# EAGLE design blink1micro-programming-jig (EAGLE 9.1.3)
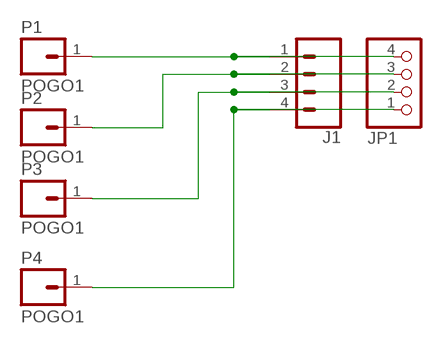
[diagram p0: schematic, sheet 1]

## Parts
J1  CONN_04  [1X04]
JP1  PINHD-1X4/90  [1X04/90]
P1  POGO1  [MILLMAX-0928-POGO-THRU]
P2  POGO1  [MILLMAX-0928-POGO-THRU]
P3  POGO1  [MILLMAX-0928-POGO-THRU]
P4  POGO1  [MILLMAX-0928-POGO-THRU]

## Nets
N$1: J1.1 JP1.4 P1.1
N$2: J1.2 JP1.3 P2.1
N$3: J1.3 JP1.2 P3.1
N$4: J1.4 JP1.1 P4.1

## Library data of the parts
J1 = SparkFun-Connectors:CONN_04: Multi connection point. Often used as Generic Header-pin footprint for 0.1 inch spaced/style header connections On any of the 0.1 inch spaced packages, you can populate with these: Break Away Headers - Straight <https://www.sparkfun.com/products/116> (PRT-00116) Break Away Male Headers - Right Angle <https://www.sparkfun.com/products/553> (PRT-00553) Female Headers <https://www.sparkfun.com/products/115> (PRT-00115) Break Away Headers - Machine Pin <https://www.sparkfun.com/products/117> (PRT-00117) Break Away Female Headers - Swiss Machine Pin <https://www.sparkfun.com/products/743> (PRT-00743) For SCREWTERMINALS and SPRING TERMINALS visit here: Screw Terimnals on SparkFun.com <https://www.sparkfun.com/search/results?term=Screw+Terminals> (5mm/3.5mm/2.54mm spacing) This device is also useful as a general connection point to wire up your design to another part of your project. Our various solder wires solder well into these plated through hole pads. Hook-Up Wire - Assortment (Stranded, 22 AWG) <https://www.sparkfun.com/products/11375> (PRT-11375) Hook-Up Wire - Assortment (Solid Core, 22 AWG) <https://www.sparkfun.com/products/11367> (PRT-11367) View the entire wire category on our website here <https://www.sparkfun.com/categories/141> Special notes: Molex polarized connector foot print use with SKU : PRT-08231 with associated crimp pins and housings. 1MM SMD Version SKU: PRT-10208; PROD_ID: CONN-09696
JP1 = pinhead:PINHD-1X4: PIN HEADER
P1-P4 = todstuff:POGO1

## Board
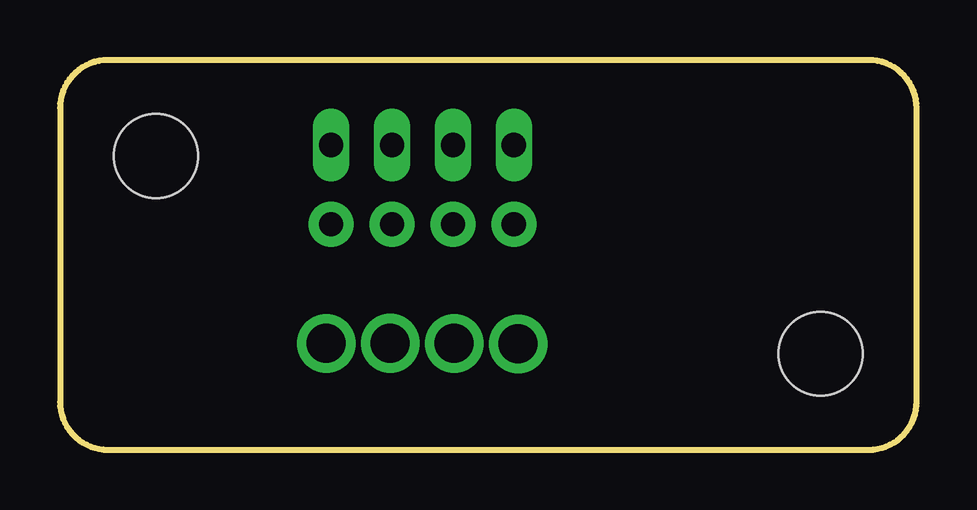
[diagram p1: board, top side]
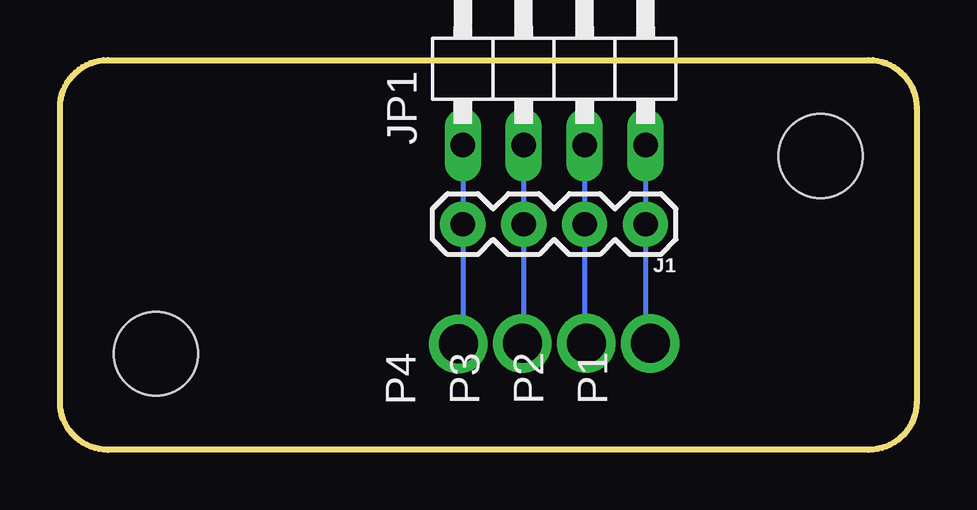
[diagram p2: board, bottom side, seen from below]

Size 35.72 x 16.24 mm. Coordinates in mm from the lower left corner, seen from the top.
Outline: 2,0 33.72,0 arc90 35.72,2 35.72,14.24 arc90 33.72,16.24 2,16.24 arc90 0,14.24 0,2 arc90 2,0
Copper layers (1*16): Top 0.035mm / dielectric 0.785mm / Bottom 0.035mm
Design rules "SeeedStudio_2layer_DRU_no_angle_20140221_blink1thin": minimum track width 6mil, minimum drill 12mil, track to track 6mil, track to pad 6mil, pad to pad 6mil, via to via 6mil, smd to smd 0mil, copper to edge 10mil, drill to drill 10mil, minimum pad ring 10mil, minimum via ring 6mil, stop-mask expansion 2mil, vias tented up to drill 100mil, thermal gap 10mil
Holes 3.5 mm at 4,12.24 31.72,4

### Footprints (pad centres in the part's own frame; a part is rotated, then mirrored left to right if it is on the bottom)
1X04 = drill 1.016 pad 1.88: 1 0,0; 2 2.54,0; 3 5.08,0; 4 7.62,0
1X04/90 = drill 1.016 long: 1 -3.81,-3.81; 2 -1.27,-3.81; 3 1.27,-3.81; 4 3.81,-3.81
MILLMAX-0928-POGO-THRU = drill 1.626 pad 2.184: 1 0,0

### Placement (x,y rotation side)
J1  11.3,9.4 180 bottom
JP1  15.11,16.51 0 bottom
P1  11.1,4.43 90 bottom
P2  13.77,4.44 90 bottom
P3  16.43,4.43 90 bottom
P4  19.1,4.41 90 bottom

### Tracks (layer width: path | path; a pad name or v marks a point on that pad's centre or on a via)
N$1
  Bottom 0.203: 11.09,4.39 P1.1 11.3,4.27 J1.1 JP1.4
N$2
  Bottom 0.203: 13.75,4.53 P2.1 13.84,4.53 J1.2 JP1.3
N$3
  Bottom 0.203: JP1.2 J1.3 16.38,4.51 P3.1
N$4
  Bottom 0.203: JP1.1 J1.4 18.92,4.41 P4.1